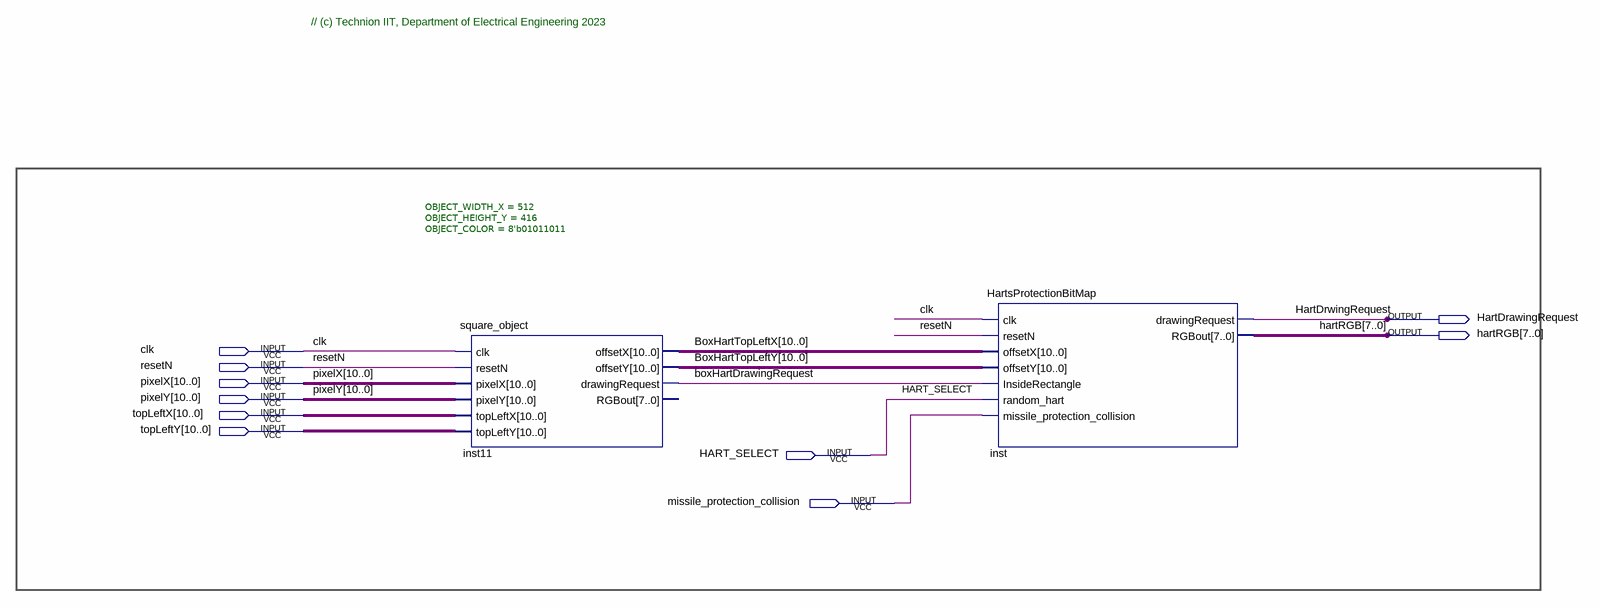
[diagram p0: schematic sheet]
// Quartus schematic HART_DISPLAY2.bdf as structural Verilog: 2 symbols, 10 pins
module HART_DISPLAY2 (
  input  clk,
  input  resetN,
  input  [10:0] pixelX,
  input  [10:0] pixelY,
  input  [10:0] topLeftX,
  input  [10:0] topLeftY,
  input  HART_SELECT,
  input  missile_protection_collision,
  output HartDrawingRequest,
  output [7:0] hartRGB
);

  wire boxHartDrawingRequest;
  wire [10:0] BoxHartTopLeftX, BoxHartTopLeftY;

  square_object #(.OBJECT_WIDTH_X(512), .OBJECT_HEIGHT_Y(416), .OBJECT_COLOR(8'b01011011)) inst11 (
    .clk(clk), .resetN(resetN), .pixelX(pixelX), .pixelY(pixelY), .topLeftX(topLeftX), .topLeftY(topLeftY),
    .offsetX(BoxHartTopLeftX), .offsetY(BoxHartTopLeftY), .drawingRequest(boxHartDrawingRequest));  // open: RGBout
  HartsProtectionBitMap inst (
    .clk(clk), .resetN(resetN), .offsetX(BoxHartTopLeftX), .offsetY(BoxHartTopLeftY),
    .InsideRectangle(boxHartDrawingRequest), .random_hart(HART_SELECT),
    .missile_protection_collision(missile_protection_collision), .drawingRequest(HartDrawingRequest),
    .RGBout(hartRGB));

  // Other names for the same wires on the sheet: HartDrwingRequest = HartDrawingRequest

  // Notes on the sheet:
  //   // (c) Technion IIT, Department of Electrical Engineering 2023
endmodule
